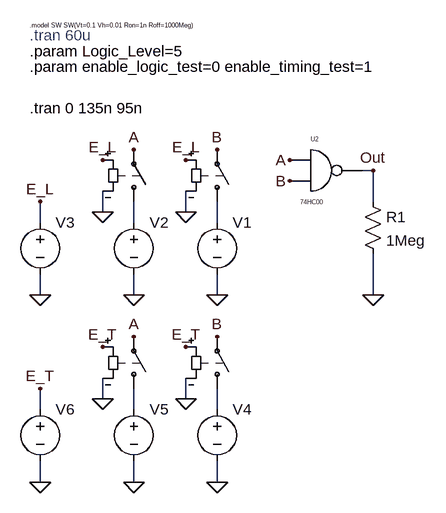
[diagram p0: schematic Test (If Spice works) 74HC00.asc]
Test (If Spice works) 74HC00.asc, the LTspice schematic file:
Version 4.1
SHEET 1 880 784
WIRE 272 48 256 48
WIRE 272 96 272 48
WIRE -144 112 -144 80
WIRE -16 112 -16 80
WIRE -240 128 -240 96
WIRE -96 128 -96 96
WIRE 32 128 32 96
WIRE -240 240 -240 208
WIRE -96 240 -96 208
WIRE 32 240 32 208
WIRE 272 240 272 176
WIRE -144 400 -144 368
WIRE -16 400 -16 368
WIRE -240 416 -240 384
WIRE -96 416 -96 384
WIRE 32 416 32 384
WIRE -240 528 -240 496
WIRE -96 528 -96 496
WIRE 32 528 32 496
FLAG -96 16 A
FLAG 32 16 B
FLAG 272 48 Out
FLAG 32 240 0
FLAG -96 240 0
FLAG 144 32 A
FLAG 144 64 B
FLAG 272 240 0
FLAG -144 112 0
FLAG -16 112 0
FLAG -240 96 E_L
FLAG -144 32 E_L
FLAG -16 32 E_L
FLAG -240 240 0
FLAG -96 304 A
FLAG 32 304 B
FLAG 32 528 0
FLAG -96 528 0
FLAG -144 400 0
FLAG -16 400 0
FLAG -240 384 E_T
FLAG -144 320 E_T
FLAG -16 320 E_T
FLAG -240 528 0
SYMBOL voltage 32 112 R0
WINDOW 3 28 83 Invisible 2
WINDOW 123 0 0 Left 0
WINDOW 39 0 0 Left 0
SYMATTR Value PWL(0 0 10u 0 10.001u 5 30u 5 30.001u 0 50u 0)
SYMATTR InstName V1
SYMBOL voltage -96 112 R0
WINDOW 3 24 96 Invisible 2
WINDOW 123 0 0 Left 0
WINDOW 39 0 0 Left 0
SYMATTR Value PWL(0 0 10u 0 10.001u 5 20u 5 20.001u 0 30u 0 30.001u 5 40u 5 40.001u 0 50u 0)
SYMATTR InstName V2
SYMBOL res 256 80 R0
SYMATTR InstName R1
SYMATTR Value 1Meg
SYMBOL sw -96 112 M180
WINDOW 0 24 16 Invisible 2
WINDOW 3 24 96 Invisible 2
SYMATTR InstName S1
SYMBOL sw 32 112 M180
WINDOW 0 24 16 Invisible 2
WINDOW 3 24 96 Invisible 2
SYMATTR InstName S2
SYMBOL voltage -240 112 R0
WINDOW 3 24 96 Invisible 2
WINDOW 123 0 0 Left 0
WINDOW 39 0 0 Left 0
SYMATTR Value {enable_logic_test * Logic_Level}
SYMATTR InstName V3
SYMBOL voltage 32 400 R0
WINDOW 3 28 83 Invisible 2
WINDOW 123 0 0 Left 0
WINDOW 39 0 0 Left 0
SYMATTR Value PULSE(5 0 100n 100p 100p 20n 1u)
SYMATTR InstName V4
SYMBOL voltage -96 400 R0
WINDOW 3 24 44 Invisible 2
WINDOW 123 0 0 Left 0
WINDOW 39 0 0 Left 0
SYMATTR Value PULSE(5 0 100n 100p 100p 20n 1u)
SYMATTR InstName V5
SYMBOL sw -96 400 M180
WINDOW 0 24 16 Invisible 2
WINDOW 3 24 96 Invisible 2
SYMATTR InstName S3
SYMBOL sw 32 400 M180
WINDOW 0 24 16 Invisible 2
WINDOW 3 24 96 Invisible 2
SYMATTR InstName S4
SYMBOL voltage -240 400 R0
WINDOW 3 24 96 Invisible 2
WINDOW 123 0 0 Left 0
WINDOW 39 0 0 Left 0
SYMATTR Value {enable_timing_test * Logic_Level}
SYMATTR InstName V6
SYMBOL ZmySymbol\\IC\\Logic\\74hc00 192 -16 R0
SYMATTR InstName U2
TEXT -256 -160 Left 2 ;.tran 60u
TEXT -256 -176 Left 0 !.model SW SW(Vt=0.1 Vh=0.01 Ron=1n Roff=1000Meg)
TEXT -256 -112 Left 2 !.param enable_logic_test=0 enable_timing_test=1
TEXT -256 -136 Left 2 !.param Logic_Level=5
TEXT -256 -48 Left 2 !.tran 0 135n 95n

The netlist it stands for:
* Test (If Spice works) 74HC00.asc
V1 N002 0 PWL(0 0 10u 0 10.001u 5 30u 5 30.001u 0 50u 0)
V2 N001 0 PWL(0 0 10u 0 10.001u 5 20u 5 20.001u 0 30u 0 30.001u 5 40u 5 40.001u 0 50u 0)
R1 Out 0 1Meg
S1 N001 A E_L 0 SW
S2 N002 B E_L 0 SW
V3 E_L 0 {enable_logic_test * Logic_Level}
V4 N004 0 PULSE(5 0 100n 100p 100p 20n 1u)
V5 N003 0 PULSE(5 0 100n 100p 100p 20n 1u)
S3 N003 A E_T 0 SW
S4 N004 B E_T 0 SW
V6 E_T 0 {enable_timing_test * Logic_Level}
X§U2 A B Out VCC 0 74HC00 VCC=5  SPEED=1.0  TRIPDT=1e-9  ; pins A B Y
* .tran 60u
.model SW SW(Vt=0.1 Vh=0.01 Ron=1n Roff=1000Meg)
.param enable_logic_test=0 enable_timing_test=1
.param Logic_Level=5
.tran 0 135n 95n
.lib 74HC.lib
.backanno
.end